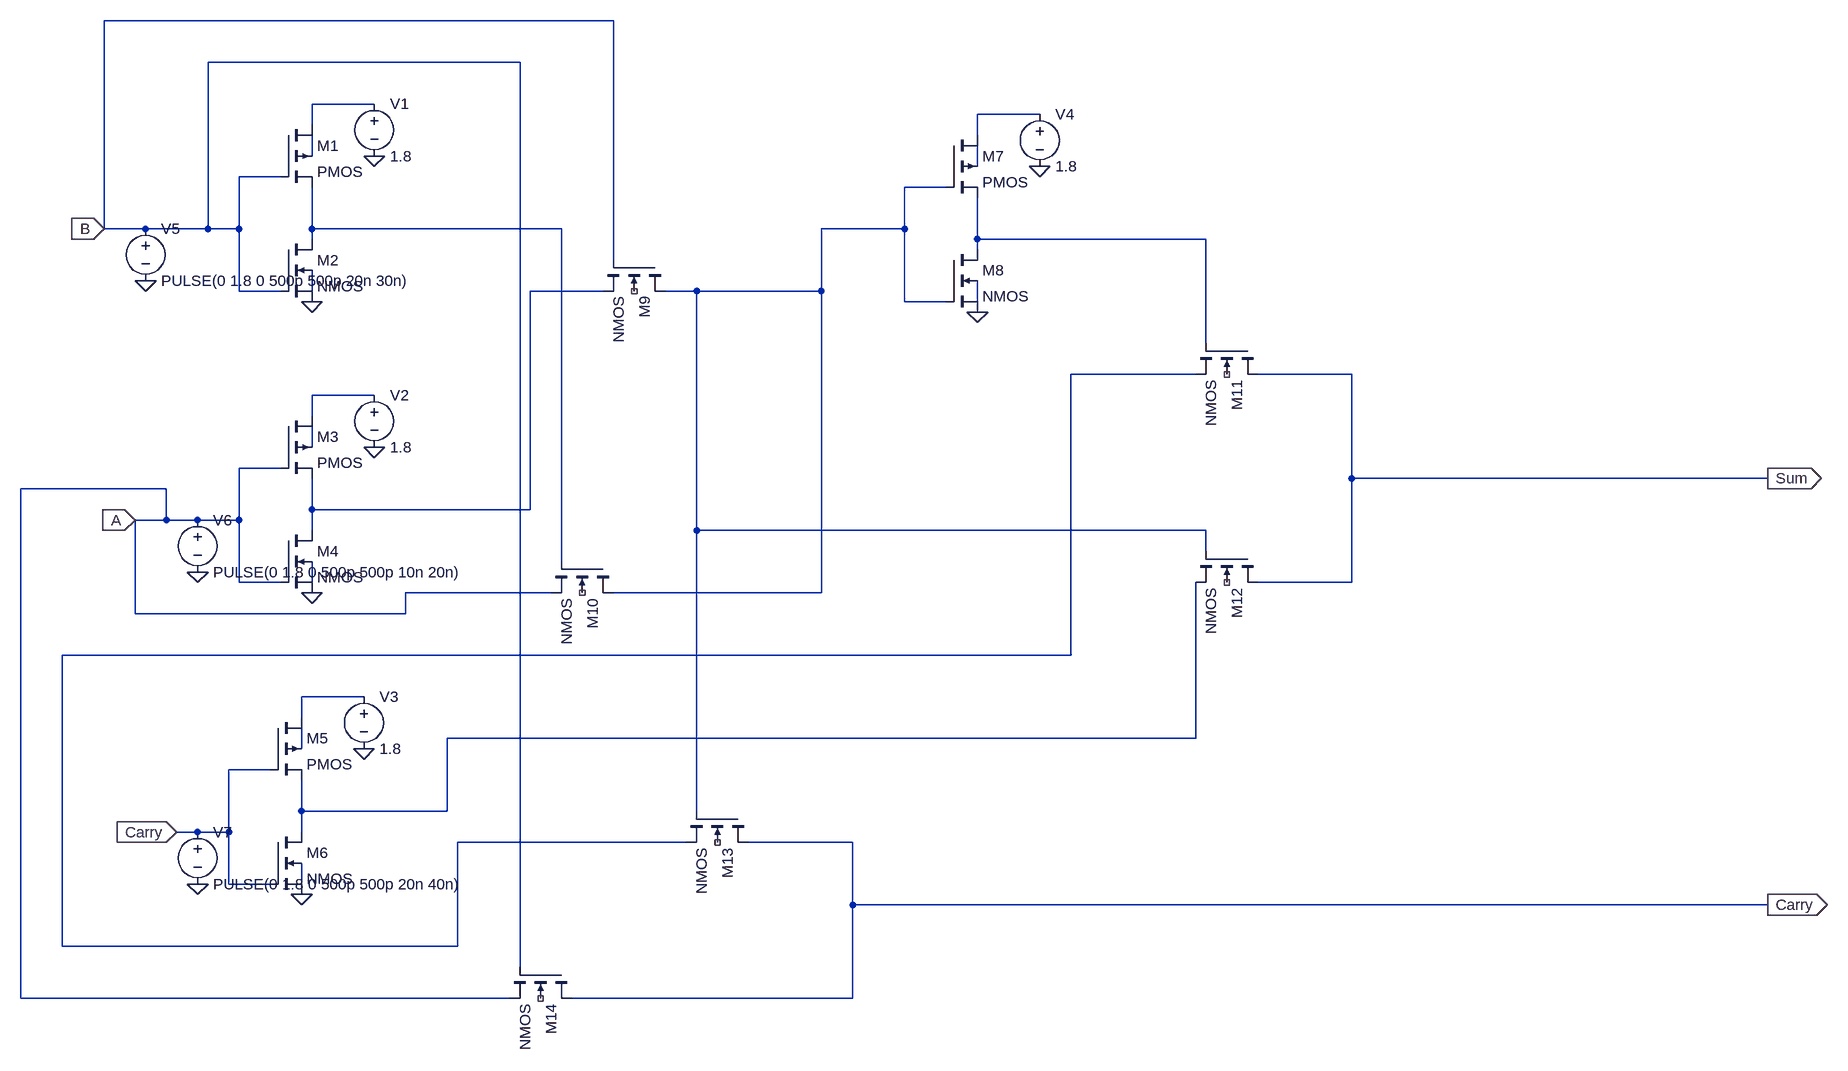
[diagram p0: schematic FullAdder.asc]
FullAdder.asc, the LTspice schematic file:
Version 4
SHEET 1 1696 1044
WIRE -176 -544 -960 -544
WIRE -320 -480 -800 -480
WIRE -544 -416 -640 -416
WIRE 480 -400 384 -400
WIRE -640 -384 -640 -416
WIRE 384 -368 384 -400
WIRE -640 -336 -640 -368
WIRE 384 -320 384 -352
WIRE -688 -304 -752 -304
WIRE 336 -288 272 -288
WIRE -960 -224 -960 -544
WIRE -896 -224 -960 -224
WIRE -800 -224 -800 -480
WIRE -800 -224 -896 -224
WIRE -752 -224 -752 -304
WIRE -752 -224 -800 -224
WIRE -640 -224 -640 -288
WIRE -256 -224 -640 -224
WIRE 272 -224 272 -288
WIRE 272 -224 144 -224
WIRE -640 -208 -640 -224
WIRE 384 -208 384 -272
WIRE 736 -208 384 -208
WIRE 384 -192 384 -208
WIRE -176 -176 -176 -544
WIRE -752 -128 -752 -224
WIRE -688 -128 -752 -128
WIRE -640 -128 -640 -160
WIRE -192 -128 -304 -128
WIRE -48 -128 -96 -128
WIRE 144 -128 144 -224
WIRE 144 -128 -48 -128
WIRE 272 -112 272 -224
WIRE 336 -112 272 -112
WIRE 384 -112 384 -144
WIRE 736 -48 736 -208
WIRE 720 0 528 0
WIRE 960 0 816 0
WIRE -544 32 -640 32
WIRE -640 64 -640 32
WIRE -640 112 -640 80
WIRE -688 144 -752 144
WIRE 960 160 960 0
WIRE 1600 160 960 160
WIRE -864 176 -1088 176
WIRE -640 208 -640 160
WIRE -304 208 -304 -128
WIRE -304 208 -640 208
WIRE -864 224 -864 176
WIRE -864 224 -912 224
WIRE -816 224 -864 224
WIRE -752 224 -752 144
WIRE -752 224 -816 224
WIRE -640 240 -640 208
WIRE -48 240 -48 -128
WIRE 736 240 -48 240
WIRE 736 272 736 240
WIRE -256 288 -256 -224
WIRE -752 320 -752 224
WIRE -688 320 -752 320
WIRE -640 320 -640 288
WIRE 960 320 960 160
WIRE 960 320 816 320
WIRE -272 336 -496 336
WIRE 144 336 144 -128
WIRE 144 336 -176 336
WIRE -912 368 -912 224
WIRE -496 368 -496 336
WIRE -496 368 -912 368
WIRE 528 432 528 0
WIRE 528 432 -1024 432
WIRE -560 496 -656 496
WIRE -656 528 -656 496
WIRE 720 560 720 320
WIRE 720 560 -432 560
WIRE -656 576 -656 544
WIRE -704 608 -768 608
WIRE -656 672 -656 624
WIRE -432 672 -432 560
WIRE -432 672 -656 672
WIRE -48 672 -48 240
WIRE -816 704 -848 704
WIRE -768 704 -768 608
WIRE -768 704 -816 704
WIRE -656 704 -656 672
WIRE -64 720 -416 720
WIRE 192 720 32 720
WIRE -768 784 -768 704
WIRE -704 784 -768 784
WIRE -656 784 -656 752
WIRE 192 816 192 720
WIRE 1600 816 192 816
WIRE -1024 880 -1024 432
WIRE -416 880 -416 720
WIRE -416 880 -1024 880
WIRE -320 912 -320 -480
WIRE -1088 960 -1088 176
WIRE -336 960 -1088 960
WIRE 192 960 192 816
WIRE 192 960 -240 960
FLAG -640 -112 0
FLAG -544 -336 0
FLAG -640 336 0
FLAG -544 112 0
FLAG -656 800 0
FLAG -560 576 0
FLAG 384 -96 0
FLAG 480 -320 0
FLAG 1600 160 Sum
IOPIN 1600 160 Out
FLAG 1600 816 Carry
IOPIN 1600 816 Out
FLAG -960 -224 B
IOPIN -960 -224 In
FLAG -912 224 A
IOPIN -912 224 In
FLAG -848 704 Carry
IOPIN -848 704 In
FLAG -896 -144 0
FLAG -816 304 0
FLAG -816 784 0
SYMBOL pmos4 -688 -384 R0
SYMATTR InstName M1
SYMBOL nmos4 -688 -208 R0
SYMATTR InstName M2
SYMBOL voltage -544 -432 R0
WINDOW 123 0 0 Left 0
WINDOW 39 0 0 Left 0
SYMATTR InstName V1
SYMATTR Value 1.8
SYMBOL pmos4 -688 64 R0
SYMATTR InstName M3
SYMBOL nmos4 -688 240 R0
SYMATTR InstName M4
SYMBOL voltage -544 16 R0
WINDOW 123 0 0 Left 0
WINDOW 39 0 0 Left 0
SYMATTR InstName V2
SYMATTR Value 1.8
SYMBOL pmos4 -704 528 R0
SYMATTR InstName M5
SYMBOL nmos4 -704 704 R0
SYMATTR InstName M6
SYMBOL voltage -560 480 R0
WINDOW 123 0 0 Left 0
WINDOW 39 0 0 Left 0
SYMATTR InstName V3
SYMATTR Value 1.8
SYMBOL pmos4 336 -368 R0
SYMATTR InstName M7
SYMBOL nmos4 336 -192 R0
SYMATTR InstName M8
SYMBOL voltage 480 -416 R0
WINDOW 123 0 0 Left 0
WINDOW 39 0 0 Left 0
SYMATTR InstName V4
SYMATTR Value 1.8
SYMBOL nmos4 -96 -176 R90
SYMATTR InstName M9
SYMBOL nmos4 -176 288 R90
SYMATTR InstName M10
SYMBOL nmos4 816 -48 R90
SYMATTR InstName M11
SYMBOL nmos4 816 272 R90
SYMATTR InstName M12
SYMBOL nmos4 32 672 R90
SYMATTR InstName M13
SYMBOL nmos4 -240 912 R90
SYMATTR InstName M14
SYMBOL voltage -896 -240 R0
WINDOW 123 0 0 Left 0
WINDOW 39 0 0 Left 0
SYMATTR InstName V5
SYMATTR Value PULSE(0 1.8 0 500p 500p 20n 30n)
SYMBOL voltage -816 208 R0
WINDOW 123 0 0 Left 0
WINDOW 39 0 0 Left 0
SYMATTR InstName V6
SYMATTR Value PULSE(0 1.8 0 500p 500p 10n 20n)
SYMBOL voltage -816 688 R0
WINDOW 123 0 0 Left 0
WINDOW 39 0 0 Left 0
SYMATTR InstName V7
SYMATTR Value PULSE(0 1.8 0 500p 500p 20n 40n)

The netlist it stands for:
* FullAdder.asc
M1 N001 B N006 N003 PMOS
M2 N006 B 0 N008 NMOS
V1 N001 0 1.8
M3 N012 A N009 N013 PMOS
M4 N009 A 0 N014 NMOS
V2 N012 0 1.8
M5 N015 Carry N016 N017 PMOS
M6 N016 Carry 0 N018 NMOS
V3 N015 0 1.8
M7 N002 N005 N007 N004 PMOS
M8 N007 N005 0 N010 NMOS
V4 N002 0 1.8
M9 N005 B N009 NC_01 NMOS
M10 N005 N006 A NC_02 NMOS
M11 Sum N007 N011 NC_03 NMOS
M12 Sum N005 N016 NC_04 NMOS
M13 Carry N005 N011 NC_05 NMOS
M14 Carry B A NC_06 NMOS
V5 B 0 PULSE(0 1.8 0 500p 500p 20n 30n)
V6 A 0 PULSE(0 1.8 0 500p 500p 10n 20n)
V7 Carry 0 PULSE(0 1.8 0 500p 500p 20n 40n)
.model NMOS NMOS
.model PMOS PMOS
.lib standard.mos
.backanno
.end